# Altium project Filtre_deneme_karti.PrjPcb
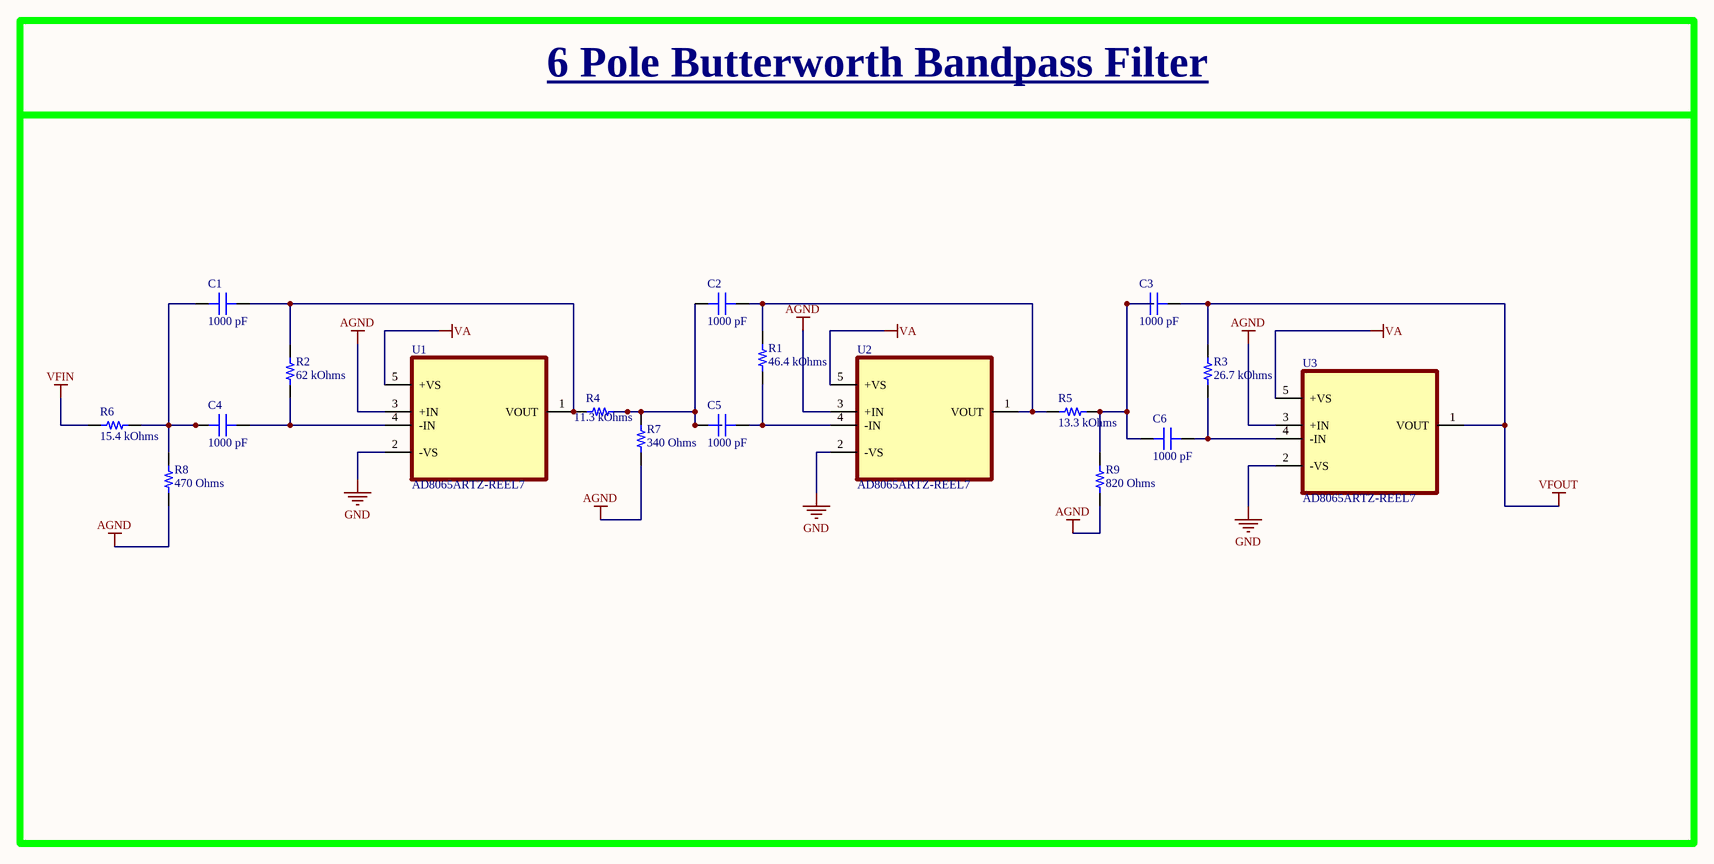
[diagram p0: 6 Pole Butterworth Bandpass Filter.SchDoc]
3 sheets, 27 parts. Net scope: global (net labels, ports and power ports of the same name join across sheets).
Board file: PCB1.PcbDoc
Sheets:
  6 Pole Butterworth Bandpass Filter.SchDoc
  ADC Buffering.SchDoc
  Input-Output.SchDoc

## Sheet 6 Pole Butterworth Bandpass Filter.SchDoc
size A3; SheetNumber: 1; SheetTotal: 3

### Parts
C1  1000 pF  [CAP 0805_2012 RF]
C2  1000 pF  [CAP 0805_2012 RF]
C3  1000 pF  [CAP 0805_2012 RF]
C4  1000 pF  [CAP 0805_2012 RF]
C5  1000 pF  [CAP 0805_2012 RF]
C6  1000 pF  [CAP 0805_2012 RF]
R1  46.4 kOhms  [RES 1206_3216 RF]
R2  62 kOhms  [RES 1206_3216 RF]
R3  26.7 kOhms  [RES 1206_3216 RF]
R4  11.3 kOhms  [RES 1206_3216 RF]
R5  13.3 kOhms  [RES 1206_3216 RF]
R6  15.4 kOhms  [RES 1206_3216 RF]
R7  340 Ohms  [RES 1206_3216 RF]
R8  470 Ohms  [RES 1206_3216 RF]
R9  820 Ohms  [RES 1206_3216 RF]
U1  AD8065ARTZ-REEL7  [SOT95P290X145-5N]
U2  AD8065ARTZ-REEL7  [SOT95P290X145-5N]
U3  AD8065ARTZ-REEL7  [SOT95P290X145-5N]

### Nets
AGND: R7.1 R8.1 R9.1 U1.3(+IN) U2.3(+IN) U3.3(+IN)
GND: U1.2(-VS) U2.2(-VS) U3.2(-VS)
VA: U1.5(+VS) U2.5(+VS) U3.5(+VS)
VFIN: R6.1
VFOUT: C3.2 R3.2 U3.1(VOUT)
NetC1_1: C1.1 C4.1 R6.2 R8.2
NetC1_2: C1.2 R2.2 R4.1 U1.1(VOUT)
NetC2_1: C2.1 C5.1 R4.2 R7.2
NetC2_2: C2.2 R1.2 R5.1 U2.1(VOUT)
NetC3_1: C3.1 C6.1 R5.2 R9.2
NetC4_2: C4.2 R2.1 U1.4(-IN)
NetC5_2: C5.2 R1.1 U2.4(-IN)
NetC6_2: C6.2 R3.1 U3.4(-IN)

### Notes on the sheet
- 6 Pole Butterworth Bandpass Filter

### Library data of the parts
C1-C6 = CS0805KRX7RBBB102: CAP CER 1000PF 500V X7R 0805; manufacturer: Yageo; Tolerance: ±10%; Part Number: CS0805KRX7RBBB102; Value: 1000 pF; Applications: Boardflex Sensitive; Capacitance: 1000 pF; componentlink1description: Datasheet; componentlink1url: http://www.yageo.com/NewPortal/yageodocoutput?fileName=/pdf/MLCC/UPY-ST_NPOX7R_16V-to-3KV_5.pdf; componentlink2description: DigiKey Link; componentlink2url: https://www.digikey.com/en/products/detail/yageo/CS0805KRX7RBBB102/6097992; Device Package: 0805 (2012 Metric); Features: Soft Termination; lastupdated: 12.04.2022 22:11:41; Lifecycle Status: Active; Minimum Order: 1; Mounting Type: Surface Mount, MLCC; Operating Temperature: -55°C ~ 125°C; Package / Case: 0805 (2012 Metric); packaging: TapeAndReel; partid: 2739; Part Status: Active; price: 0.06; series: CS; Size / Dimension: 0.079" L x 0.049" W (2.00mm x 1.25mm); Supplier 1: DigiKey; Supplier Part Number 1: 311-3593-1-ND; Temperature Coefficient: X7R; Thickness (Max): 0.039" (1.00mm); Voltage - Rated: 500V
R1 = RT0805DRE0746K4L: RES SMD 46.4K OHM 0.5% 1/8W 0805; Manufacturer: Yageo; Power (Watts): 0.125W, 1/8W; Temperature Coefficient: ±50ppm/°C; Part Number: RT0805DRE0746K4L; Value: 46.4 kOhms; ComponentLink1Description: Datasheet; ComponentLink1URL: https://www.yageo.com/upload/media/product/productsearch/datasheet/rchip/PYu-RT_1-to-0.01_RoHS_L_11.pdf; ComponentLink2Description: DigiKey Link; ComponentLink2URL: https://www.digikey.com/en/products/detail/yageo/RT0805DRE0746K4L/1078715; Composition: Thin Film; Device Package: 0805 (2012 Metric); Height - Seated (Max): 0.024" (0.60mm); LastUpdated: 12.04.2022 22:40:28; Lifecycle Status: Active; Minimum Order: 1; Number of Terminations: 2; Operating Temperature: -55°C ~ 155°C; Package / Case: 0805 (2012 Metric); Packaging: TapeAndReel; PartId: 31477; Part Status: Active; Price: 0.01; Resistance: 46.4 kOhms; Series: RT; Size / Dimension: 0.079" L x 0.049" W (2.00mm x 1.25mm); Supplier 1: DigiKey; Supplier Part Number 1: 311-2866-1-ND; Supplier Device Package: 0805; Tolerance: ±0.5%
R2 = CPF0805B62KE1: RES SMD 62K OHM 0.1% 1/10W 0805; Manufacturer: TE Connectivity Passive Product; Power (Watts): 0.1W, 1/10W; Temperature Coefficient: ±25ppm/°C; Part Number: CPF0805B62KE1; Value: 62 kOhms; ComponentLink1Description: Datasheet; ComponentLink1URL: https://www.te.com/commerce/DocumentDelivery/DDEController?Action=srchrtrv&DocNm=1773200&DocType=DS&DocLang=English; ComponentLink2Description: DigiKey Link; ComponentLink2URL: https://www.digikey.com/en/products/detail/te-connectivity-passive-product/CPF0805B62KE1/2382068; Composition: Thin Film; Device Package: 0805 (2012 Metric); Height - Seated (Max): 0.026" (0.65mm); LastUpdated: 12.04.2022 22:40:19; Lifecycle Status: Active; Minimum Order: 1; Number of Terminations: 2; Operating Temperature: -55°C ~ 155°C; Package / Case: 0805 (2012 Metric); Packaging: TapeAndReel; PartId: 34241; Part Status: Active; Price: 0.13; Resistance: 62 kOhms; Series: CPF, Neohm; Size / Dimension: 0.079" L x 0.049" W (2.00mm x 1.25mm); Supplier 1: DigiKey; Supplier Part Number 1: A103230CT-ND; Supplier Device Package: 0805; Tolerance: ±0.1%
R3 = ERJ-6ENF2672V: RES SMD 26.7K OHM 1% 1/8W 0805; Manufacturer: Panasonic Electronic Components; Power (Watts): 0.125W, 1/8W; Temperature Coefficient: ±100ppm/°C; Part Number: ERJ-6ENF2672V; Value: 26.7 kOhms; ComponentLink1Description: Datasheet; ComponentLink1URL: https://industrial.panasonic.com/cdbs/www-data/pdf/RDA0000/AOA0000C304.pdf; ComponentLink2Description: DigiKey Link; ComponentLink2URL: https://www.digikey.com/en/products/detail/panasonic-electronic-components/ERJ-6ENF2672V/111557; Composition: Thick Film; Device Package: 0805 (2012 Metric); Features: Automotive AEC-Q200; Height - Seated (Max): 0.028" (0.70mm); LastUpdated: 12.04.2022 22:40:32; Lifecycle Status: Active; Minimum Order: 1; Number of Terminations: 2; Operating Temperature: -55°C ~ 155°C; Package / Case: 0805 (2012 Metric); Packaging: TapeAndReel; PartId: 30267; Part Status: Active; Price: 0.01; Ratings: AEC-Q200; Resistance: 26.7 kOhms; Series: ERJ-6EN; Size / Dimension: 0.079" L x 0.049" W (2.00mm x 1.25mm); Supplier 1: DigiKey; Supplier Part Number 1: P26.7KCCT-ND; Supplier Device Package: 0805; Tolerance: ±1%
R4 = RK73H2ATTD1132F: RES 11.3K OHM 1% 1/4W 0805; Manufacturer: KOA Speer Electronics, Inc.; Power (Watts): 0.25W, 1/4W; Temperature Coefficient: ±100ppm/°C; Part Number: RK73H2ATTD1132F; Value: 11.3 kOhms; ComponentLink1Description: Datasheet; ComponentLink1URL: http://www.koaspeer.com/catimages/Products/RK73H/RK73H.pdf; ComponentLink2Description: DigiKey Link; ComponentLink2URL: https://www.digikey.com/en/products/detail/koa-speer-electronics-inc/RK73H2ATTD1132F/10233627; Composition: Thick Film; Device Package: 0805 (2012 Metric); Features: Automotive AEC-Q200, Moisture Resistant; Height - Seated (Max): 0.024" (0.60mm); LastUpdated: 12.04.2022 22:40:20; Lifecycle Status: Active; Minimum Order: 1; Number of Terminations: 2; Operating Temperature: -55°C ~ 155°C; Package / Case: 0805 (2012 Metric); Packaging: TapeAndReel; PartId: 33915; Part Status: Active; Price: 0.01; Ratings: AEC-Q200; Resistance: 11.3 kOhms; Series: RK73H; Size / Dimension: 0.079" L x 0.049" W (2.00mm x 1.25mm); Supplier 1: DigiKey; Supplier Part Number 1: 2019-RK73H2ATTD1132FCT-ND; Supplier Device Package: 0805; Tolerance: ±1%
R5 = RK73H2BTTD1332F: RES 13.3K OHM 1% 1/4W 1206; Manufacturer: KOA Speer Electronics, Inc.; Power (Watts): 0.25W, 1/4W; Temperature Coefficient: ±100ppm/°C; Part Number: RK73H2BTTD1332F; ComponentLink1Description: Datasheet; ComponentLink1URL: http://www.koaspeer.com/catimages/Products/RK73H/RK73H.pdf; ComponentLink2Description: DigiKey Link; ComponentLink2URL: https://www.digikey.com/en/products/detail/koa-speer-electronics-inc/RK73H2BTTD1332F/10236178; Composition: Thick Film; Device Package: 1206 (3216 Metric); Features: Automotive AEC-Q200, Moisture Resistant; Height - Seated (Max): 0.028" (0.70mm); LastUpdated: 12.04.2022 22:34:22; Lifecycle Status: Active; Minimum Order: 1; Number of Terminations: 2; Operating Temperature: -55°C ~ 155°C; Package / Case: 1206 (3216 Metric); Packaging: TapeAndReel; PartId: 27243; Part Status: Active; Price: 0.01; Ratings: AEC-Q200; Resistance: 13.3 kOhms; Series: RK73H; Size / Dimension: 0.126" L x 0.063" W (3.20mm x 1.60mm); Supplier 1: DigiKey; Supplier Part Number 1: 2019-RK73H2BTTD1332FCT-ND; Supplier Device Package: 1206; Tolerance: ±1%; Value: 13.3 kOhms
R6 = ERJ-6ENF1542V: RES SMD 15.4K OHM 1% 1/8W 0805; Manufacturer: Panasonic Electronic Components; Power (Watts): 0.125W, 1/8W; Temperature Coefficient: ±100ppm/°C; Part Number: ERJ-6ENF1542V; Value: 15.4 kOhms; ComponentLink1Description: Datasheet; ComponentLink1URL: https://industrial.panasonic.com/cdbs/www-data/pdf/RDA0000/AOA0000C304.pdf; ComponentLink2Description: DigiKey Link; ComponentLink2URL: https://www.digikey.com/en/products/detail/panasonic-electronic-components/ERJ-6ENF1542V/111510; Composition: Thick Film; Device Package: 0805 (2012 Metric); Features: Automotive AEC-Q200; Height - Seated (Max): 0.028" (0.70mm); LastUpdated: 12.04.2022 22:40:33; Lifecycle Status: Active; Minimum Order: 1; Number of Terminations: 2; Operating Temperature: -55°C ~ 155°C; Package / Case: 0805 (2012 Metric); Packaging: TapeAndReel; PartId: 30250; Part Status: Active; Price: 0.01; Ratings: AEC-Q200; Resistance: 15.4 kOhms; Series: ERJ-6EN; Size / Dimension: 0.079" L x 0.049" W (2.00mm x 1.25mm); Supplier 1: DigiKey; Supplier Part Number 1: P15.4KCCT-ND; Supplier Device Package: 0805; Tolerance: ±1%
R7 = ERJ-8ENF3400V: RES SMD 340 OHM 1% 1/4W 1206; Manufacturer: Panasonic Electronic Components; Power (Watts): 0.25W, 1/4W; Temperature Coefficient: ±100ppm/°C; Part Number: ERJ-8ENF3400V; ComponentLink1Description: Datasheet; ComponentLink1URL: https://industrial.panasonic.com/cdbs/www-data/pdf/RDA0000/AOA0000C304.pdf; ComponentLink2Description: DigiKey Link; ComponentLink2URL: https://www.digikey.com/en/products/detail/panasonic-electronic-components/ERJ-8ENF3400V/88773; Composition: Thick Film; Device Package: 1206 (3216 Metric); Features: Automotive AEC-Q200; Height - Seated (Max): 0.028" (0.70mm); LastUpdated: 12.04.2022 22:34:11; Lifecycle Status: Active; Minimum Order: 1; Number of Terminations: 2; Operating Temperature: -55°C ~ 155°C; Package / Case: 1206 (3216 Metric); Packaging: TapeAndReel; PartId: 29324; Part Status: Active; Price: 0.02; Ratings: AEC-Q200; Resistance: 340 Ohms; Series: ERJ-8EN; Size / Dimension: 0.126" L x 0.063" W (3.20mm x 1.60mm); Supplier 1: DigiKey; Supplier Part Number 1: P340FCT-ND; Supplier Device Package: 1206; Tolerance: ±1%; Value: 340 Ohms
R8 = CRGP0805F470R: RES 470 OHM 1% 1/3W 0805; Manufacturer: TE Connectivity Passive Product; Power (Watts): 0.333W, 1/3W; Temperature Coefficient: ±100ppm/°C; Part Number: CRGP0805F470R; Value: 470 Ohms; ComponentLink1Description: Datasheet; ComponentLink1URL: https://www.te.com/commerce/DocumentDelivery/DDEController?Action=srchrtrv&DocNm=9-1773463-9&DocType=DS&DocLang=English; ComponentLink2Description: DigiKey Link; ComponentLink2URL: https://www.digikey.com/en/products/detail/te-connectivity-passive-product/CRGP0805F470R/8577075; Composition: Thick Film; Device Package: 0805 (2012 Metric); Features: Pulse Withstanding; Height - Seated (Max): 0.026" (0.65mm); LastUpdated: 12.04.2022 22:40:38; Lifecycle Status: Active; Minimum Order: 1; Number of Terminations: 2; Operating Temperature: -55°C ~ 155°C; Package / Case: 0805 (2012 Metric); Packaging: TapeAndReel; PartId: 28801; Part Status: Active; Price: 0.03; Resistance: 470 Ohms; Series: CRGP; Size / Dimension: 0.079" L x 0.049" W (2.00mm x 1.25mm); Supplier 1: DigiKey; Supplier Part Number 1: A130473CT-ND; Supplier Device Package: 0805; Tolerance: ±1%
R9 = CR0805-JW-821EPF: RES 0805 820R 5% 125MW TC200 LOW; Manufacturer: Bourns Inc.; Power (Watts): 0.125W, 1/8W; Temperature Coefficient: ±200ppm/°C; Part Number: CR0805-JW-821EPF; Value: 820 Ohms; ComponentLink1Description: Datasheet; ComponentLink1URL: https://www.bourns.com/docs/Product-Datasheets/CR-PF.pdf; ComponentLink2Description: DigiKey Link; ComponentLink2URL: https://www.digikey.com/en/products/detail/bourns-inc/CR0805-JW-821EPF/8572952; Composition: Thick Film; Device Package: 0805 (2012 Metric); Height - Seated (Max): 0.024" (0.60mm); LastUpdated: 12.04.2022 22:39:27; Lifecycle Status: Active; Minimum Order: 1; Number of Terminations: 2; Operating Temperature: -55°C ~ 155°C; Package / Case: 0805 (2012 Metric); Packaging: TapeAndReel; PartId: 46969; Part Status: Active; Price: 0.01; Resistance: 820 Ohms; Series: CR-PF; Size / Dimension: 0.079" L x 0.049" W (2.00mm x 1.25mm); Supplier 1: DigiKey; Supplier Part Number 1: CR0805-JW-821EPFCT-ND; Supplier Device Package: 0805; Tolerance: ±5%
U1-U3 = AD8065ARTZ-REEL7: Voltage Feedback Amplifier 1 Circuit Rail-to-Rail SOT-23-5; MF: Analog Devices; Price: None; Package: SOT-23-5 Analog Devices; Value: *; MP: AD8065ARTZ-REEL7; DigiKey-Purchase-URL: https://snapeda.com/shop?store=DigiKey&id=385700; SnapEDA_Link: https://www.snapeda.com/parts/AD8065ARTZ-REEL7/Analog%20Devices%20Inc./view-part/385700/?ref=snap; Availability: Unavailable

## Sheet ADC Buffering.SchDoc
size A4; SheetNumber: 2; SheetTotal: 3
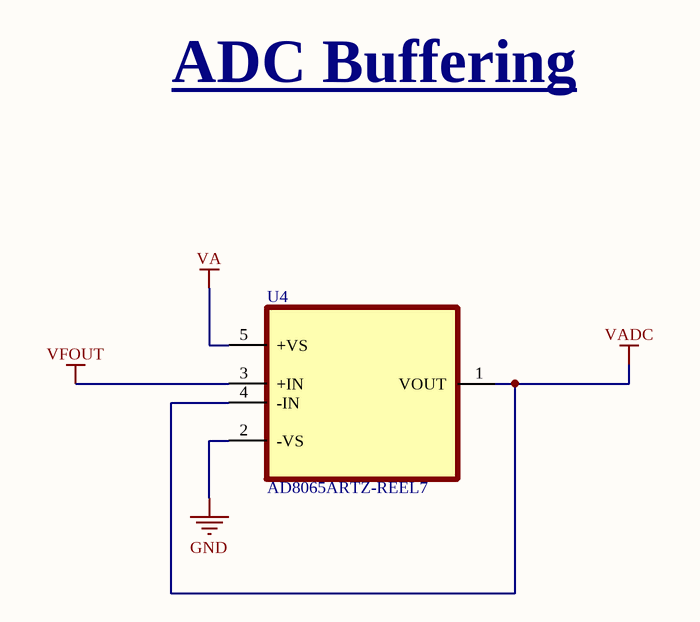
[diagram p1: ADC Buffering.SchDoc]

### Parts
U4  AD8065ARTZ-REEL7  [SOT95P290X145-5N]

### Nets
GND: U4.2(-VS)
VA: U4.5(+VS)
VADC: U4.1(VOUT) U4.4(-IN)
VFOUT: U4.3(+IN)

### Notes on the sheet
- ADC Buffering

### Library data of the parts
U4 = AD8065ARTZ-REEL7: as U1 on sheet 6 Pole Butterworth Bandpass Filter; Price: None; Package: SOT-23-5 Analog Devices; Value: *; MP: AD8065ARTZ-REEL7; DigiKey-Purchase-URL: https://snapeda.com/shop?store=DigiKey&id=385700; SnapEDA_Link: https://www.snapeda.com/parts/AD8065ARTZ-REEL7/Analog%20Devices%20Inc./view-part/385700/?ref=snap; Availability: Unavailable

## Sheet Input-Output.SchDoc
size A4; SheetNumber: 3; SheetTotal: 3
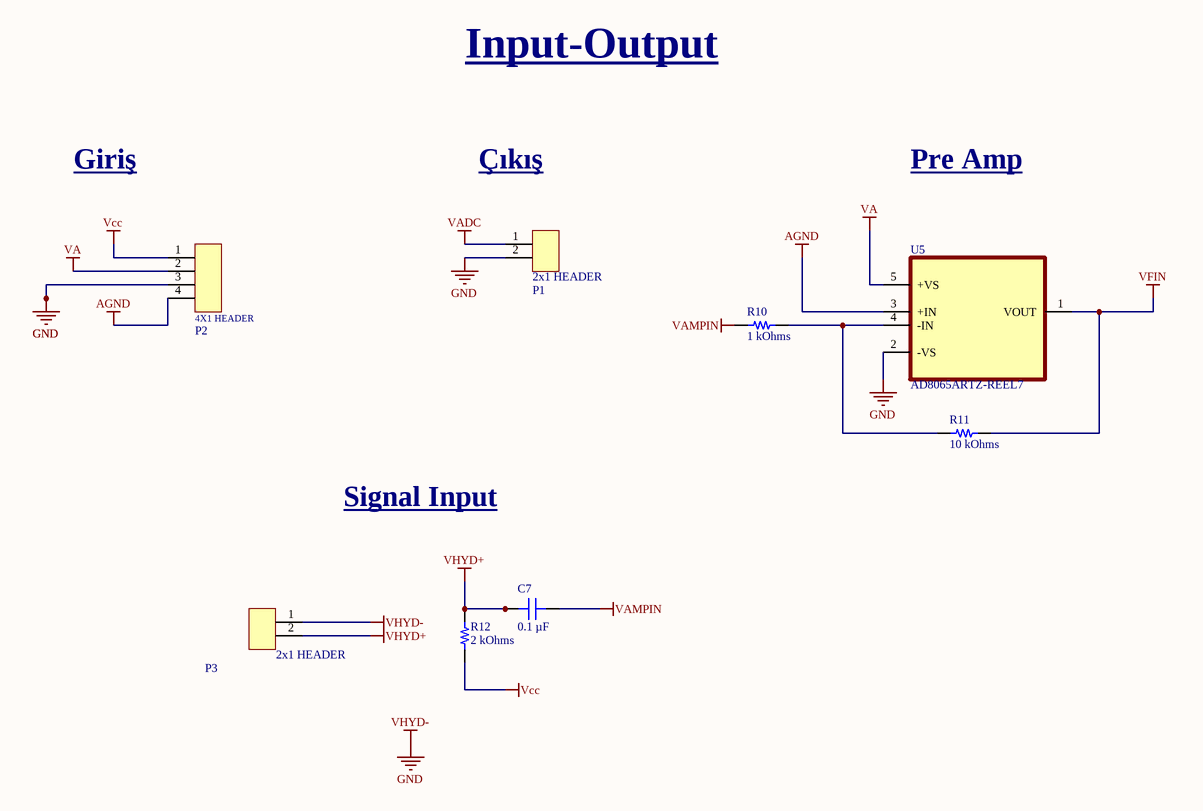
[diagram p2: Input-Output.SchDoc]

### Parts
C7  0.1 µF  [RES 0805_2012]
P1  WIRE-TO BOARD WAFER, 2.5MM, 2 CO  [51025-02-0100-01]  (value not drawn)
P2  WIRE-TO BOARD HEADER, 2.5MM, 4 C  [51125-04-0200-01]  (value not drawn)
P3  WIRE-TO BOARD WAFER, 2.5MM, 2 CO  [51025-02-0100-01]  (value not drawn)
R10  1 kOhms  [RES 1206_3216 RF]
R11  10 kOhms  [RES 1206_3216 RF]
R12  2 kOhms  [RES 1206_3216 RF]
U5  AD8065ARTZ-REEL7  [SOT95P290X145-5N]

### Nets
AGND: P2.4 U5.3(+IN)
GND: P1.2 P2.3 P3.1 U5.2(-VS)  [also labelled VHYD-]
VA: P2.2 U5.5(+VS)
VADC: P1.1
VAMPIN: C7.2 R10.1
Vcc: P2.1 R12.1
VFIN: R11.2 U5.1(VOUT)
VHYD+: C7.1 P3.2 R12.2
NetR10_2: R10.2 R11.1 U5.4(-IN)

### Notes on the sheet
- Input-Output
- Giriş
- Çıkış
- Pre Amp
- Signal Input
- (in symbol 51025-02-0100-01) 2x1 HEADER
- (in symbol 51125-04-0200-01) 4X1 HEADER

### Library data of the parts
C7 = CC0805MRX7R9BB104: CAP CER 0.1UF 50V X7R 0805; manufacturer: Yageo; Tolerance: ±20%; Part Number: CC0805MRX7R9BB104; Value: 0.1 µF; Applications: General Purpose; Capacitance: 0.1 µF; componentlink1description: Datasheet; componentlink1url: https://www.yageo.com/upload/media/product/productsearch/datasheet/mlcc/UPY-GPHC_X7R_6.3V-to-50V_18.pdf; componentlink2description: DigiKey Link; componentlink2url: https://www.digikey.com/en/products/detail/yageo/CC0805MRX7R9BB104/5884281; Device Package: 0805 (2012 Metric); lastupdated: 12.04.2022 22:11:41; Lifecycle Status: Active; Minimum Order: 1; Mounting Type: Surface Mount, MLCC; Operating Temperature: -55°C ~ 125°C; Package / Case: 0805 (2012 Metric); packaging: TapeAndReel; partid: 2475; Part Status: Active; price: 0.02; series: CC; Size / Dimension: 0.079" L x 0.049" W (2.00mm x 1.25mm); Supplier 1: DigiKey; Supplier Part Number 1: 311-4351-1-ND; Temperature Coefficient: X7R; Thickness (Max): 0.037" (0.95mm); Voltage - Rated: 50V
P1 P3 = 51025-02-0100-01: Connector Header Through Hole 2 position 0.098" (2.50mm); Manufacturer: CNC Tech; Supplier 1: Digi-Key; Manufacturer Part Number: 51025-02-0100-01; RoHS: No; Stock 1: 15526; Pricing 1: 1=0,10000, 10=0,08300, 100=0,06090, 500=0,05040, 1000=0,04410, 5000=0,03780, 10000=0,03675 (USD); Supplier Part Number 1: 1175-51025-02-0100-01-ND
P2 = 51125-04-0200-01: Manufacturer: CNC Tech; Supplier 1: Digi-Key; Manufacturer Part Number: 51125-04-0200-01; RoHS: No; Category: Connectors; Stock 1: 5369; Pricing 1: 1=0,21000, 10=0,17700, 100=0,13650, 500=0,11550, 1000=0,09450, 5000=0,08400, 10000=0,07613 (USD); Supplier Part Number 1: 1175-51125-04-0200-01-ND
R10 = CRGH0805J1K0: RES SMD 1K OHM 5% 1/3W 0805; Manufacturer: TE Connectivity Passive Product; Power (Watts): 0.333W, 1/3W; Temperature Coefficient: ±100ppm/°C; Part Number: CRGH0805J1K0; Value: 1 kOhms; ComponentLink1Description: Datasheet; ComponentLink1URL: https://www.te.com/commerce/DocumentDelivery/DDEController?Action=srchrtrv&DocNm=1773204-1&DocType=DS&DocLang=English; ComponentLink2Description: DigiKey Link; ComponentLink2URL: https://www.digikey.com/en/products/detail/te-connectivity-passive-product/CRGH0805J1K0/2385524; Composition: Thick Film; Device Package: 0805 (2012 Metric); LastUpdated: 12.04.2022 22:40:40; Lifecycle Status: Active; Minimum Order: 1; Number of Terminations: 2; Operating Temperature: -55°C ~ 155°C; Package / Case: 0805 (2012 Metric); Packaging: TapeAndReel; PartId: 28125; Part Status: Active; Price: 0.01; Resistance: 1 kOhms; Series: CRGH, Neohm; Size / Dimension: 0.083" L x 0.051" W (2.10mm x 1.30mm); Supplier 1: DigiKey; Supplier Part Number 1: A126435CT-ND; Supplier Device Package: 0805; Tolerance: ±5%
R11 = RNCF0805DTE10K0: RES 10K OHM 0.5% 1/8W 0805; Manufacturer: Stackpole Electronics Inc; Power (Watts): 0.125W, 1/8W; Temperature Coefficient: ±25ppm/°C; Part Number: RNCF0805DTE10K0; Value: 10 kOhms; ComponentLink1Description: Datasheet; ComponentLink1URL: https://www.seielect.com/catalog/sei-rncf.pdf; ComponentLink2Description: DigiKey Link; ComponentLink2URL: https://www.digikey.com/en/products/detail/stackpole-electronics-inc/RNCF0805DTE10K0/1708247; Composition: Thin Film; Device Package: 0805 (2012 Metric); Features: Automotive AEC-Q200; Height - Seated (Max): 0.026" (0.65mm); LastUpdated: 12.04.2022 22:40:40; Lifecycle Status: Active; Minimum Order: 1; Number of Terminations: 2; Operating Temperature: -55°C ~ 155°C; Package / Case: 0805 (2012 Metric); Packaging: TapeAndReel; PartId: 28029; Part Status: Active; Price: 0.01; Ratings: AEC-Q200; Resistance: 10 kOhms; Series: RNCF; Size / Dimension: 0.079" L x 0.049" W (2.00mm x 1.25mm); Supplier 1: DigiKey; Supplier Part Number 1: RNCF0805DTE10K0CT-ND; Supplier Device Package: 0805; Tolerance: ±0.5%
R12 = RCS08052K00FKEA: RES SMD 2K OHM 1% 0.4W 0805; Manufacturer: Vishay Dale; Power (Watts): 0.4W, 2/5W; Temperature Coefficient: ±100ppm/°C; Part Number: RCS08052K00FKEA; Value: 2 kOhms; ComponentLink1Description: Datasheet; ComponentLink1URL: http://www.vishay.com/docs/20065/rcse3.pdf; ComponentLink2Description: DigiKey Link; ComponentLink2URL: https://www.digikey.com/en/products/detail/vishay-dale/RCS08052K00FKEA/5866986; Composition: Thick Film; Device Package: 0805 (2012 Metric); Features: Automotive AEC-Q200, Pulse Withstanding; Height - Seated (Max): 0.020" (0.50mm); LastUpdated: 12.04.2022 22:40:41; Lifecycle Status: Active; Minimum Order: 1; Number of Terminations: 2; Operating Temperature: -55°C ~ 155°C; Package / Case: 0805 (2012 Metric); Packaging: TapeAndReel; PartId: 27786; Part Status: Active; Price: 0.03; Ratings: AEC-Q200; Resistance: 2 kOhms; Series: RCS e3; Size / Dimension: 0.079" L x 0.049" W (2.00mm x 1.25mm); Supplier 1: DigiKey; Supplier Part Number 1: 541-2840-1-ND; Supplier Device Package: 0805; Tolerance: ±1%
U5 = AD8065ARTZ-REEL7: as U1 on sheet 6 Pole Butterworth Bandpass Filter; Price: None; Package: SOT-23-5 Analog Devices; Value: *; MP: AD8065ARTZ-REEL7; DigiKey-Purchase-URL: https://snapeda.com/shop?store=DigiKey&id=385700; SnapEDA_Link: https://www.snapeda.com/parts/AD8065ARTZ-REEL7/Analog%20Devices%20Inc./view-part/385700/?ref=snap; Availability: Unavailable

## Nets that join several sheets
AGND: 6 Pole Butterworth Bandpass Filter (6 pins), Input-Output (P2.4 U5.3)
GND: 6 Pole Butterworth Bandpass Filter (U1.2 U2.2 U3.2), ADC Buffering (U4.2), Input-Output (P1.2 P2.3 P3.1 U5.2)
VA: 6 Pole Butterworth Bandpass Filter (U1.5 U2.5 U3.5), ADC Buffering (U4.5), Input-Output (P2.2 U5.5)
VADC: ADC Buffering (U4.1 U4.4), Input-Output (P1.1)
VFIN: 6 Pole Butterworth Bandpass Filter (R6.1), Input-Output (R11.2 U5.1)
VFOUT: 6 Pole Butterworth Bandpass Filter (C3.2 R3.2 U3.1), ADC Buffering (U4.3)